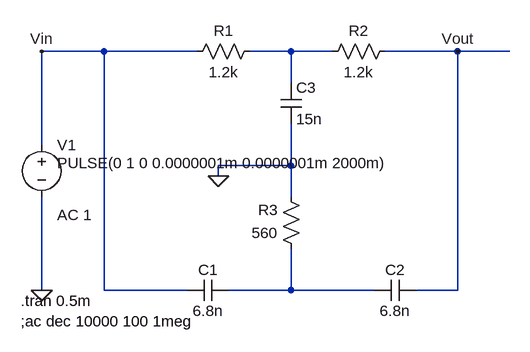
[diagram p0: schematic notchG.asc]
notchG.asc, the LTspice schematic file:
Version 4
SHEET 1 880 680
WIRE -16 80 -112 80
WIRE 128 80 -16 80
WIRE 272 80 208 80
WIRE 336 80 272 80
WIRE 528 80 416 80
WIRE 608 80 528 80
WIRE 272 128 272 80
WIRE -112 224 -112 80
WIRE 272 256 272 192
WIRE 272 256 160 256
WIRE 160 272 160 256
WIRE 272 304 272 256
WIRE -112 448 -112 304
WIRE -16 448 -16 80
WIRE 112 448 -16 448
WIRE 272 448 272 384
WIRE 272 448 176 448
WIRE 400 448 272 448
WIRE 528 448 528 80
WIRE 528 448 464 448
FLAG 160 272 0
FLAG -112 448 0
FLAG 528 80 Vout
FLAG -112 80 Vin
SYMBOL res 224 64 R90
WINDOW 0 0 56 VBottom 2
WINDOW 3 32 56 VTop 2
SYMATTR InstName R1
SYMATTR Value 1.2k
SYMATTR SpiceLine tol=10
SYMBOL res 432 64 R90
WINDOW 0 0 56 VBottom 2
WINDOW 3 32 56 VTop 2
SYMATTR InstName R2
SYMATTR Value 1.2k
SYMATTR SpiceLine tol=10
SYMBOL res 288 400 R180
WINDOW 0 36 76 Left 2
WINDOW 3 36 40 Left 2
SYMATTR InstName R3
SYMATTR Value 560
SYMBOL cap 256 128 R0
SYMATTR InstName C3
SYMATTR Value 15n
SYMBOL cap 176 432 R90
WINDOW 0 0 32 VBottom 2
WINDOW 3 32 32 VTop 2
SYMATTR InstName C1
SYMATTR Value 6.8n
SYMBOL cap 464 432 R90
WINDOW 0 0 32 VBottom 2
WINDOW 3 32 32 VTop 2
SYMATTR InstName C2
SYMATTR Value 6.8n
SYMBOL voltage -112 208 R0
WINDOW 123 24 124 Left 2
WINDOW 39 0 0 Left 0
WINDOW 3 24 44 Left 2
SYMATTR Value2 AC 1
SYMATTR Value PULSE(0 1 0 0.0000001m 0.0000001m 2000m)
SYMATTR InstName V1
TEXT -144 496 Left 2 !;ac dec 10000 100 1meg
TEXT -144 464 Left 2 !.tran 0.5m

The netlist it stands for:
* notchG.asc
R1 N001 Vin 1.2k tol=10
R2 Vout N001 1.2k tol=10
R3 N002 0 560
C3 N001 0 15n
C1 N002 Vin 6.8n
C2 Vout N002 6.8n
V1 Vin 0 PULSE(0 1 0 0.0000001m 0.0000001m 2000m) AC 1
;ac dec 10000 100 1meg
.tran 0.5m
.backanno
.end